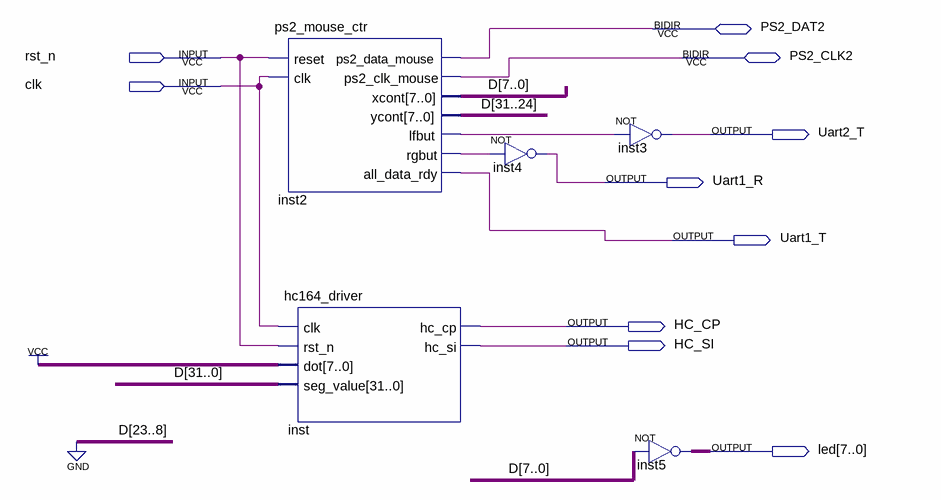
[diagram p0: schematic sheet]
// Quartus schematic ps2_mouse.bdf as structural Verilog: 5 symbols, 10 pins
module ps2_mouse (
  input  rst_n,
  input  clk,
  inout  PS2_DAT2,
  inout  PS2_CLK2,
  output Uart2_T,
  output Uart1_R,
  output Uart1_T,
  output HC_CP,
  output HC_SI,
  output [7:0] led
);

  wire inst2_lfbut, inst2_rgbut;
  wire [31:0] D;

  ps2_mouse_ctr inst2 (
    .reset(rst_n), .clk(clk), .xcont(D[7:0]), .ycont(D[31:24]), .lfbut(inst2_lfbut), .rgbut(inst2_rgbut),
    .all_data_rdy(Uart1_T), .ps2_data_mouse(PS2_DAT2), .ps2_clk_mouse(PS2_CLK2));
  hc164_driver inst (
    .clk(clk), .rst_n(rst_n), .dot({8{1'b1}}), .seg_value({D[31:24], {16{1'b0}}, D[7:0]}), .hc_cp(HC_CP),
    .hc_si(HC_SI));
  not inst4 (Uart1_R, inst2_rgbut);
  not inst3 (Uart2_T, inst2_lfbut);
  assign led = ~D[7:0];  // NOT inst5, 8 bits wide
endmodule
